# Altium schematic sheet LKS_EVB_MVPOW_V4.0.SchDoc
size A3; SheetNumber: 1; SheetTotal: 1
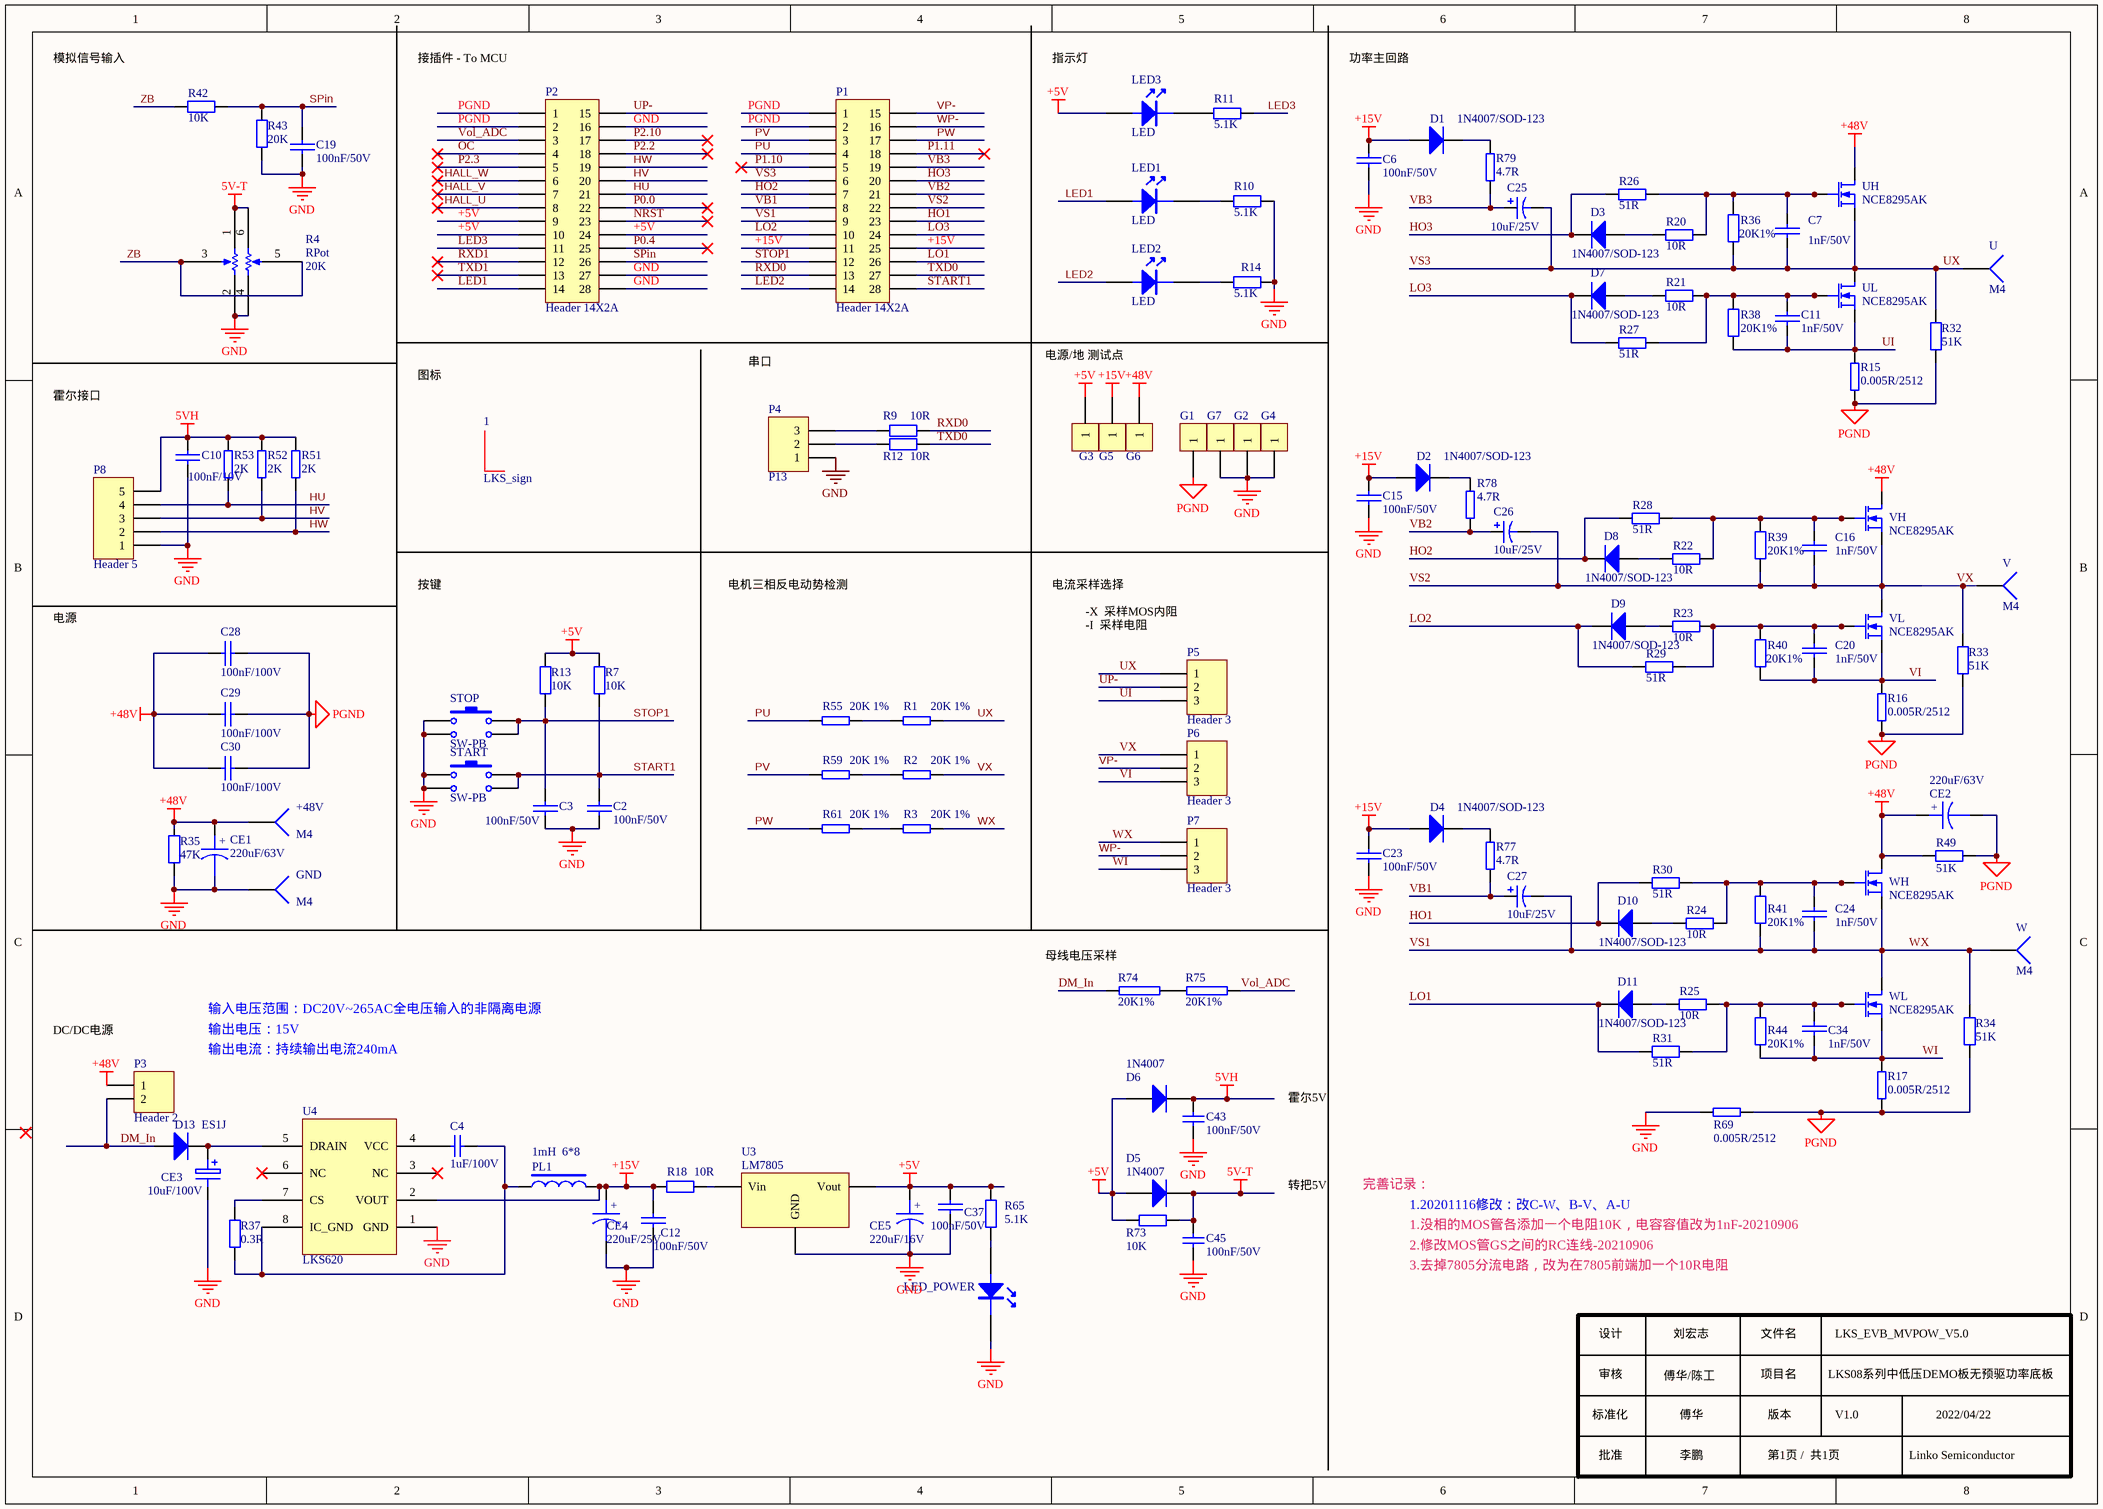
[diagram p0: LKS_EVB_MVPOW_V4.0.SchDoc]

## Parts
1  LKS_sign  [LKS_LOGO2]
+48V  M4  [M4_Conector]
C2  100nF/50V  [0603C]
C3  100nF/50V  [0603C]
C4  1uF/100V  [1206]
C6  100nF/50V  [0603C]
C7  1nF/50V  [0603C]
C10  100nF/10V  [0603C]
C11  1nF/50V  [0603C]
C12  100nF/50V  [0603C]
C15  100nF/50V  [0603C]
C16  1nF/50V  [0603C]
C19  100nF/50V  [0603C]
C20  1nF/50V  [0603C]
C23  100nF/50V  [0603C]
C24  1nF/50V  [0603C]
C25  10uF/25V  [1206]
C26  10uF/25V  [1206]
C27  10uF/25V  [1206]
C28  100nF/100V  [0805C]
C29  100nF/100V  [0805C]
C30  100nF/100V  [0805C]
C34  1nF/50V  [0603C]
C37  100nF/50V  [0603C]
C43  100nF/50V  [0603C]
C45  100nF/50V  [0603C]
CE1  220uF/63V  [220UF/63V 12.5*12.5]
CE2  220uF/63V  [220UF/63V 12.5*12.5]
CE3  10uF/100V  [220UF/25V paster8*10]
CE4  220uF/25V  [220UF/25V 8*10]
CE5  220uF/16V  [220UF/16V 6.3*7.7]
D1  1N4007/SOD-123  [SOD123]
D2  1N4007/SOD-123  [SOD123]
D3  1N4007/SOD-123  [SOD123]
D4  1N4007/SOD-123  [SOD123]
D5  1N4007  [D1206]
D6  1N4007  [D1206]
D7  1N4007/SOD-123  [SOD123]
D8  1N4007/SOD-123  [SOD123]
D9  1N4007/SOD-123  [SOD123]
D10  1N4007/SOD-123  [SOD123]
D11  1N4007/SOD-123  [SOD123]
D13  ES1J  [DO-214AC]
G1  PAD1.2  [PAD1.2]  (value not drawn)
G2  PAD1.2  [PAD1.2]  (value not drawn)
G3  PAD1.2  [PAD1.2]  (value not drawn)
G4  PAD1.2  [PAD1.2]  (value not drawn)
G5  PAD1.2  [PAD1.2]  (value not drawn)
G6  PAD1.2  [PAD1.2]  (value not drawn)
G7  PAD1.2  [PAD1.2]  (value not drawn)
GND  M4  [M4_Conector]
LED1  LED  [SOD323]
LED2  LED  [SOD323]
LED3  LED  [SOD323]
LED_POWER  LED_R  [SOD323]  (value not drawn)
P1  Header 14X2A  [HDR2X14_CEN]
P2  Header 14X2A  [HDR2X14_CEN]
P3  Header 2  [HDR1X2]
P4  P13  [2.54-XH-3A-180]
P5  Header 3  [HDR1X3]
P6  Header 3  [HDR1X3]
P7  Header 3  [HDR1X3]
P8  Header 5  [2.54-XH-5A-180]
PL1  1mH  6*8  [L_DIP_6*8MM]
R1  20K 1%  [0805R]
R2  20K 1%  [0805R]
R3  20K 1%  [0805R]
R4  RPot  value 20K  [RK097-W-1]
R7  10K  [0603R]
R9  10R  [0603R]
R10  5.1K  [0603R]
R11  5.1K  [0603R]
R12  10R  [0603R]
R13  10K  [0603R]
R14  5.1K  [0603R]
R15  0.005R/2512  [2512]
R16  0.005R/2512  [2512]
R17  0.005R/2512  [2512]
R18  10R  [1206R]
R20  10R  [0805R]
R21  10R  [0805R]
R22  10R  [0805R]
R23  10R  [0805R]
R24  10R  [0805R]
R25  10R  [0805R]
R26  51R  [0805R]
R27  51R  [0805R]
R28  51R  [0805R]
R29  51R  [0805R]
R30  51R  [0805R]
R31  51R  [0805R]
R32  51K  [0805R]
R33  51K  [0805R]
R34  51K  [0805R]
R35  47K  [1206R]
R36  20K1%  [0603R]
R37  0.3R  [1206]
R38  20K1%  [0603R]
R39  20K1%  [0603R]
R40  20K1%  [0603R]
R41  20K1%  [0603R]
R42  10K  [0603R]
R43  20K  [0603R]
R44  20K1%  [0603R]
R49  51K  [0805R]
R51  2K  [0603R]
R52  2K  [0603R]
R53  2K  [0603R]
R55  20K 1%  [0805R]
R59  20K 1%  [0805R]
R61  20K 1%  [0805R]
R65  5.1K  [0603R]
R69  0.005R/2512  [2512]
R73  10K  [0603R]
R74  20K1%  [0603R]
R75  20K1%  [0603R]
R77  4.7R  [0805r]
R78  4.7R  [0805r]
R79  4.7R  [0805r]
START  SW-PB  [SW-PB  12*12]
STOP  SW-PB  [SW-PB  12*12]
U  M4  [M4_Conector]
U3  LM7805  [SOT-89]
U4  LKS620  [SO-8]
UH  NCE8295AK  [TO-252]
UL  NCE8295AK  [TO-252]
V  M4  [M4_Conector]
VH  NCE8295AK  [TO-252]
VL  NCE8295AK  [TO-252]
W  M4  [M4_Conector]
WH  NCE8295AK  [TO-252]
WL  NCE8295AK  [TO-252]

## Nets
5V-T: C45.2 D5.2(K) R4.1(TOP) R4.6(TOP) R73.2
5VH: C10.1 C43.2 D6.2(K) P8.5 R51.2 R52.2 R53.2
+5V: C37.2 CE5.1 D5.1(A) D6.1(A) G3.1 LED3.1(A) P2.9 P2.10 P2.24 R7.1 R13.2 R65.1 R73.1 U3.1(Vout)
+15V: C6.2 C12.1 C15.2 C23.2 CE4.1 D1.1(A) D2.1(A) D4.1(A) G5.1 P1.11 P1.25 PL1.1 R18.1 U4.2(VOUT)
+48V: +48V.1 C28.2 C29.2 C30.2 CE1.1 CE2.1 G6.1 P3.1 R35.1 R49.1 UH.2(D) VH.2(D) WH.2(D)
GND: C2.1 C3.2 C6.1 C10.2 C12.2 C15.1 C19.1 C23.1 C37.1 C43.1 C45.1 CE1.2 CE3.2 CE4.2 CE5.2 G2.1 G4.1 G7.1 GND.1 LED_POWER.2(K) P2.16 P2.27 P2.28 P4.1 P8.1 R4.2(TAP) R4.4(BOT) R10.2 R14.2 R35.2 R43.1 R69.2 START.1 START.3 STOP.1 STOP.3 U3.2(GND) U4.1(GND)
PGND: C28.1 C29.1 C30.1 CE2.2 G1.1 P1.1 P1.2 P2.1 P2.2 R15.2 R16.1 R17.2 R32.1 R33.1 R34.1 R49.2 R69.1
DM_In: D13.1(A) P3.2 R74.1
HALL_U: P2.8
HALL_V: P2.7
HALL_W: P2.6
HO1: D10.2(K) P1.23 R30.1
HO2: D8.2(K) P1.7 R28.1
HO3: D3.2(K) P1.20 R26.1
HU: P2.21 P8.4 R53.1
HV: P2.20 P8.3 R52.1
HW: P2.19 P8.2 R51.1
LED1: LED1.1(A) P2.14
LED2: LED2.1(A) P1.14
LED3: P2.11 R11.2
LO1: D11.2(K) P1.26 R31.1
LO2: D9.2(K) P1.10 R29.1
LO3: D7.2(K) P1.24 R27.1
NRST: P2.23
OC: P2.4
P0.0: P2.22
P0.4: P2.25
P1.10: P1.5
P1.11: P1.18
P2.2: P2.18
P2.3: P2.5
P2.10: P2.17
PU: P1.4 R55.1
PV: P1.3 R59.1
PW: P1.17 R61.1
RXD0: P1.13 R9.1
RXD1: P2.12
SPin: C19.2 P2.26 R42.2 R43.2
START1: C2.2 P1.28 R7.2 START.2 START.4
STOP1: C3.1 P1.12 R13.1 STOP.2 STOP.4
TXD0: P1.27 R12.2
TXD1: P2.13
UI: C11.2 P5.3 R15.1 R38.1 UL.3(S)
UP-: P2.15 P5.2
UX: C7.2 C25.2 P1.6 P5.1 R1.2 R32.2 R36.1 U.1 UH.3(S) UL.2(D)  [also labelled VS3]
VB1: C27.1 P1.8 R77.1
VB2: C26.1 P1.21 R78.1
VB3: C25.1 P1.19 R79.1
VI: C20.2 P6.3 R16.2 R40.1 VL.3(S)
Vol_ADC: P2.3 R75.2
VP-: P1.15 P6.2
VS1: C24.2 C27.2 P1.9 P7.1 R3.2 R34.2 R41.1 W.1 WH.3(S) WL.2(D)  [also labelled WX]
VS2: C16.2 C26.2 P1.22 P6.1 R2.2 R33.2 R39.1 V.1 VH.3(S) VL.2(D)  [also labelled VX]
WI: C34.2 P7.3 R17.1 R44.1 WL.3(S)
WP-: P1.16 P7.2
ZB: R4.3(BOT) R4.5(TAP) R42.1
NetC4_1: C4.1 U4.4(VCC)
NetC4_2: C4.2 PL1.2 R37.1 U4.8(IC_GND)
NetC7_1: C7.1 R20.1 R26.2 R36.2 UH.1(G)
NetC11_1: C11.1 R21.1 R27.2 R38.2 UL.1(G)
NetC16_1: C16.1 R22.1 R28.2 R39.2 VH.1(G)
NetC20_1: C20.1 R23.1 R29.2 R40.2 VL.1(G)
NetC24_1: C24.1 R24.1 R30.2 R41.2 WH.1(G)
NetC34_1: C34.1 R25.1 R31.2 R44.2 WL.1(G)
NetCE3_1: CE3.1 D13.2(K) U4.5(DRAIN)
NetD1_2: D1.2(K) R79.2
NetD2_2: D2.2(K) R78.2
NetD3_1: D3.1(A) R20.2
NetD4_2: D4.2(K) R77.2
NetD7_1: D7.1(A) R21.2
NetD8_1: D8.1(A) R22.2
NetD9_1: D9.1(A) R23.2
NetD10_1: D10.1(A) R24.2
NetD11_1: D11.1(A) R25.2
NetLED1_2: LED1.2(K) R10.1
NetLED2_2: LED2.2(K) R14.1
NetLED3_2: LED3.2(K) R11.1
NetLED_POWER_1: LED_POWER.1(A) R65.2
NetP4_2: P4.2 R12.1
NetP4_3: P4.3 R9.2
NetR1_1: R1.1 R55.2
NetR2_1: R2.1 R59.2
NetR3_1: R3.1 R61.2
NetR18_2: R18.2 U3.3(Vin)
NetR37_2: R37.2 U4.7(CS)
NetR74_2: R74.2 R75.1

Not connected (* = marked no-connect by the designer): U4 3(NC)* 6(NC)*

## Notes on the sheet
- 模拟信号输入
- 接插件 - To MCU
- 指示灯
- 功率主回路
- 图标
- 串口
- 电源/地 测试点
- 霍尔接口
- 按键
- 电机三相反电动势检测
- 电流采样选择
- 电源
- -X  采样MOS内阻
- -I  采样电阻
- (near R74) 母线电压采样
- DC/DC电源
- 输入电压范围：DC20V~265AC全电压输入的非隔离电源
- 输出电压：15V
- 输出电流：持续输出电流240mA
- 完善记录：
- 1.20201116修改：改C-W、B-V、A-U
- 1.没相的MOS管各添加一个电阻10K，电容容值改为1nF-20210906
- 2.修改MOS管GS之间的RC连线-20210906
- 3.去掉7805分流电路，改为在7805前端加一个10R电阻
- 设计
- 审核
- 傅华/陈工
- 刘宏志
- 文件名
- 项目名
- LKS08系列中低压DEMO板无预驱功率底板
- LKS_EVB_MVPOW_V5.0
- 标准化
- 批准
- 傅华
- 李鹏
- 版本
- 第1页 /  共1页
- V1.0
- Linko Semiconductor
- 2022/04/22
- Labels drawn without touching a wire or pin: 转把5V, 霍尔5V
- (in symbol Capacitor Pol) +

## Library data of the parts
+48V GND U V W = Socket: LatestRevisionDate: 17-Jul-2002; LatestRevisionNote: Re-released for DXP Platform.; Publisher: Altium Limited
C2 C3 C7 C10-C12 C16 C20 C24 C28-C30 C34 = CAP: Capacitor
C4 = Cap: Capacitor; Value: 10uF/100V; Published: 8-Jun-2000; LatestRevisionDate: 17-Jul-2002; LatestRevisionNote: Re-released for DXP Platform.; PackageReference: RAD-0.3; Publisher: Altium Limited; PackageDescription: Radial Cap, Thru-Hole; 2 Leads; 0.3 in Pin Spacing
C6 C15 C19 C23 C37 = C: Capacitor
C25-C27 = Cap Pol1: Polarized Capacitor (Radial); Value: 47uF/50V; Published: 8-Jun-2000; LatestRevisionDate: 17-Jul-2002; LatestRevisionNote: Re-released for DXP Platform.; PackageReference: RB7.6-15; Publisher: Altium Limited; = Value: 47uF/50V
C43 C45 = Cap: Capacitor; Value: 104; Published: 8-Jun-2000; LatestRevisionDate: 17-Jul-2002; LatestRevisionNote: Re-released for DXP Platform.; PackageReference: RAD-0.3; Publisher: Altium Limited; PackageDescription: Radial Cap, Thru-Hole; 2 Leads; 0.3 in Pin Spacing
CE1 CE2 CE4 CE5 = Capacitor Pol: Capacitor---电解电容
CE3 = CD: Electrolytic Capacitor
D1-D4 D7-D11 D13 = Diode: Default Diode; Published: 8-Jun-2000; LatestRevisionDate: 17-Jul-2002; LatestRevisionNote: Re-released for DXP Platform.; PackageDocument: Sep-1996; PackageReference: SMC; Publisher: Altium Limited; Code_JEDEC: DO-214-AB
D5 D6 = Diode 1N4007: 1 Amp General Purpose Rectifier; Published: 8-Jun-2000; LatestRevisionDate: 17-Jul-2002; LatestRevisionNote: Re-released for DXP Platform.; DatasheetVersion: 1998; PackageVersion: Aug-1999; PackageReference: DO-41; Publisher: Altium Limited; PackageDescription: Diode, Axial; Body 5.2 x 2.7 mm (LxDia. max), Lead Dia. 0.86 mm (max); Code_JEDEC: DO-204-AL; ComponentLink1Description: Manufacturer Link; ComponentLink1URL: http://www.fairchildsemi.com/; ComponentLink2Description: Datasheet; ComponentLink2URL: http://www.fairchildsemi.com/ds/1N%2F1N4001.pdf
G1-G7 = CON1: Connector
LED_POWER = LED
P1 P2 = Header 14X2A: Header, 14-Pin, Dual row; LatestRevisionDate: 17-Jul-2002; LatestRevisionNote: Re-released for DXP Platform.; Publisher: Altium Limited
P3 = Header 2: Header, 2-Pin; LatestRevisionDate: 17-Jul-2002; LatestRevisionNote: Re-released for DXP Platform.; Publisher: Altium Limited
P4-P7 = Header 3: Header, 3-Pin; LatestRevisionDate: 17-Jul-2002; LatestRevisionNote: Re-released for DXP Platform.; Publisher: Altium Limited
P8 = Header 5: Header, 5-Pin; LatestRevisionDate: 17-Jul-2002; LatestRevisionNote: Re-released for DXP Platform.; Publisher: Altium Limited
PL1 = L
R1-R3 R51-R53 R55 R59 R61 = RES/1
R4 = RPot: Potentiometer; Sim Note: Enter the Resistance value and the set point into parameter fields.; Set Position: 0.5; Published: 8-Jun-2000; LatestRevisionDate: 17-Jul-2002; LatestRevisionNote: Re-released for DXP Platform.; PackageReference: VR5; Publisher: Altium Limited; PackageDescription: Variable Resistor, Thru-Hole; 3 Leads
R7 R9 R13 R73 = Res2: Resistor; Published: 8-Jun-2000; LatestRevisionDate: 17-Jul-2002; LatestRevisionNote: Re-released for DXP Platform.; Publisher: Altium Limited
  R7 R13: PackageReference: AXIAL-0.4; Value: 10K
  R9: PackageReference: 0603R
  R73: PackageReference: AXIAL-0.4; PackageDescription: Axial Device, Thru-Hole; 2 Leads; 0.4 in Pin Spacing; Value: 10K
R10 R11 R14 = Res2: Resistor; Value: 10K; Published: 8-Jun-2000; LatestRevisionDate: 17-Jul-2002; LatestRevisionNote: Re-released for DXP Platform.; PackageReference: AXIAL-0.4; Publisher: Altium Limited
R12 = Res2: Resistor; Value: 100R; Published: 8-Jun-2000; LatestRevisionDate: 17-Jul-2002; LatestRevisionNote: Re-released for DXP Platform.; PackageReference: 0603R; Publisher: Altium Limited
R15-R17 R69 R77-R79 = RES2短
R18 R26 R35 R36 R38-R44 = Res: Resistor; Value: K; Published: 8-Jun-2000; LatestRevisionDate: 17-Jul-2002; LatestRevisionNote: Re-released for DXP Platform.; PackageReference: AXIAL-0.4; Publisher: Altium Limited; PackageDescription: Axial Device, Thru-Hole; 2 Leads; 0.4 in Pin Spacing
R20-R25 R27-R34 R49 = 1Res: Resistor; Value: K; Published: 8-Jun-2000; LatestRevisionDate: 17-Jul-2002; LatestRevisionNote: Re-released for DXP Platform.; PackageReference: AXIAL-0.4; Publisher: Altium Limited; PackageDescription: Axial Device, Thru-Hole; 2 Leads; 0.4 in Pin Spacing
R37 = Res2: Resistor; Value: 1R; Published: 8-Jun-2000; LatestRevisionDate: 17-Jul-2002; LatestRevisionNote: Re-released for DXP Platform.; PackageReference: AXIAL-0.4; Publisher: Altium Limited; PackageDescription: Axial Device, Thru-Hole; 2 Leads; 0.4 in Pin Spacing
R65 = Res2: Resistor; Value: 510R; Published: 8-Jun-2000; LatestRevisionDate: 17-Jul-2002; LatestRevisionNote: Re-released for DXP Platform.; PackageReference: 0603R; Publisher: Altium Limited; PackageDescription: Axial Device, Thru-Hole; 2 Leads; 0.4 in Pin Spacing
R74 R75 = R
START STOP = SW-PB: Switch; Published: 24-Mar-1999; LatestRevisionDate: 17-Jul-2002; LatestRevisionNote: Re-released for DXP Platform.; PackageReference: SPST-2; Publisher: Altium Limited; PackageDescription: Switch; 2 Leads
U3 = VOL-78
UH UL VH VL WH WL = MOS